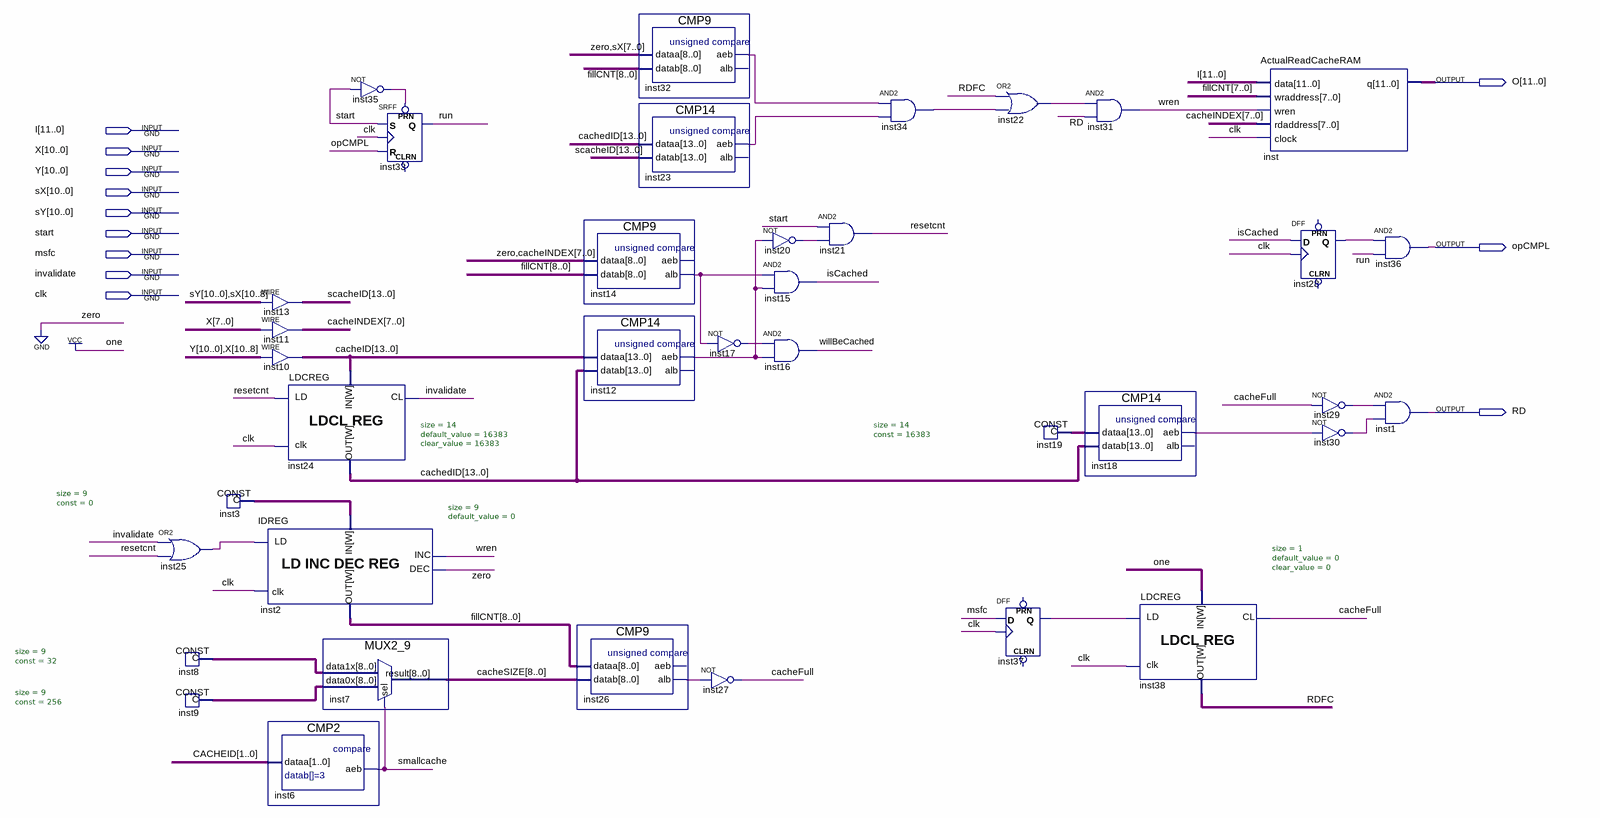
[diagram p0: schematic sheet]
// Quartus schematic ReadCache.bdf as structural Verilog: 37 symbols, 12 pins
module ReadCache (
  input  [11:0] I,
  input  [10:0] X,
  input  [10:0] Y,
  input  [10:0] sX,
  input  [10:0] sY,
  input  start,
  input  msfc,
  input  invalidate,
  input  clk,
  output [11:0] O,
  output opCMPL,
  output RD
);

  wire cacheFull, inst12_aeb, inst14_alb, inst17_out, inst18_aeb, inst20_out, inst22_out, inst23_aeb,
       inst25_out, inst26_alb, inst28_q, inst29_out, inst30_out, inst32_aeb, inst34_out, inst35_out,
       inst37_q, isCached, RDFC, resetcnt, run, smallcache, willBeCached, wren;
  wire [7:0] cacheINDEX;
  wire [8:0] cacheSIZE, fillCNT, inst3_data, inst8_data, inst9_data;
  wire [13:0] cachedID, CACHEID, inst19_data, scacheID;

  or inst25 (inst25_out, invalidate, resetcnt);
  CONST #(.size(9), .\const (32)) inst8 (.data(inst8_data));
  CONST #(.size(9), .\const (256)) inst9 (.data(inst9_data));
  assign scacheID = {sY, sX[10:8]};  // WIRE inst13
  assign cacheINDEX = X[7:0];  // WIRE inst11
  assign CACHEID = {Y, X[10:8]};  // WIRE inst10
  CONST #(.size(9), .\const (0)) inst3 (.data(inst3_data));
  IDREG #(.size(9), .default_value(0)) inst2 (
    .clk(clk), .data_in(inst3_data), .inc(wren), .dec(1'b0), .ld(inst25_out), .data_out(fillCNT));
  LDCREG #(.size(14), .default_value(16383), .clear_value(16383)) inst24 (
    .clk(clk), .data_in(CACHEID), .cl(invalidate), .ld(resetcnt), .data_out(cachedID));
  CMP2 inst6 (.dataa(CACHEID[1:0]), .aeb(smallcache));
  not inst35 (inst35_out, start);
  MUX2_9 inst7 (.data1x(inst8_data), .data0x(inst9_data), .sel(smallcache), .result(cacheSIZE));
  SRFF inst33 (.PRN(inst35_out), .S(start), .R(opCMPL), .CLK(clk), .Q(run));  // open: CLRN
  CMP9 inst14 (.dataa({1'b0, cacheINDEX}), .datab(fillCNT), .alb(inst14_alb));  // open: aeb
  CMP14 inst12 (.dataa(CACHEID), .datab(cachedID), .aeb(inst12_aeb));  // open: alb
  CMP9 inst26 (.dataa(fillCNT), .datab(cacheSIZE), .alb(inst26_alb));  // open: aeb
  CMP9 inst32 (.dataa({1'b0, sX[7:0]}), .datab(fillCNT), .aeb(inst32_aeb));  // open: alb
  CMP14 inst23 (.dataa(cachedID), .datab(scacheID), .aeb(inst23_aeb));  // open: alb
  not inst27 (cacheFull, inst26_alb);
  not inst17 (inst17_out, inst14_alb);
  not inst20 (inst20_out, inst12_aeb);
  and inst15 (isCached, inst14_alb, inst12_aeb);
  and inst16 (willBeCached, inst17_out, inst12_aeb);
  and inst21 (resetcnt, start, inst20_out);
  and inst34 (inst34_out, inst32_aeb, inst23_aeb);
  or inst22 (inst22_out, RDFC, inst34_out);
  CONST #(.size(14), .\const (16383)) inst19 (.data(inst19_data));
  DFF inst37 (.CLK(clk), .D(msfc), .Q(inst37_q));  // open: CLRN, PRN
  and inst31 (wren, inst22_out, RD);
  CMP14 inst18 (.dataa(inst19_data), .datab(cachedID), .aeb(inst18_aeb));  // open: alb
  LDCREG #(.size(1), .default_value(0), .clear_value(0)) inst38 (
    .clk(clk), .data_in(1'b1), .cl(cacheFull), .ld(inst37_q), .data_out(RDFC));
  ActualReadCacheRAM inst (.data(I), .wraddress(fillCNT[7:0]), .wren(wren), .rdaddress(cacheINDEX), .clock(clk), .q(O));
  DFF inst28 (.CLK(clk), .D(isCached), .Q(inst28_q));  // open: CLRN, PRN
  not inst29 (inst29_out, cacheFull);
  not inst30 (inst30_out, inst18_aeb);
  and inst36 (opCMPL, inst28_q, run);
  and inst1 (RD, inst29_out, inst30_out);
endmodule
